# EAGLE board CORS_Time_Reference (EAGLE 9.6.2), part 1 of 2
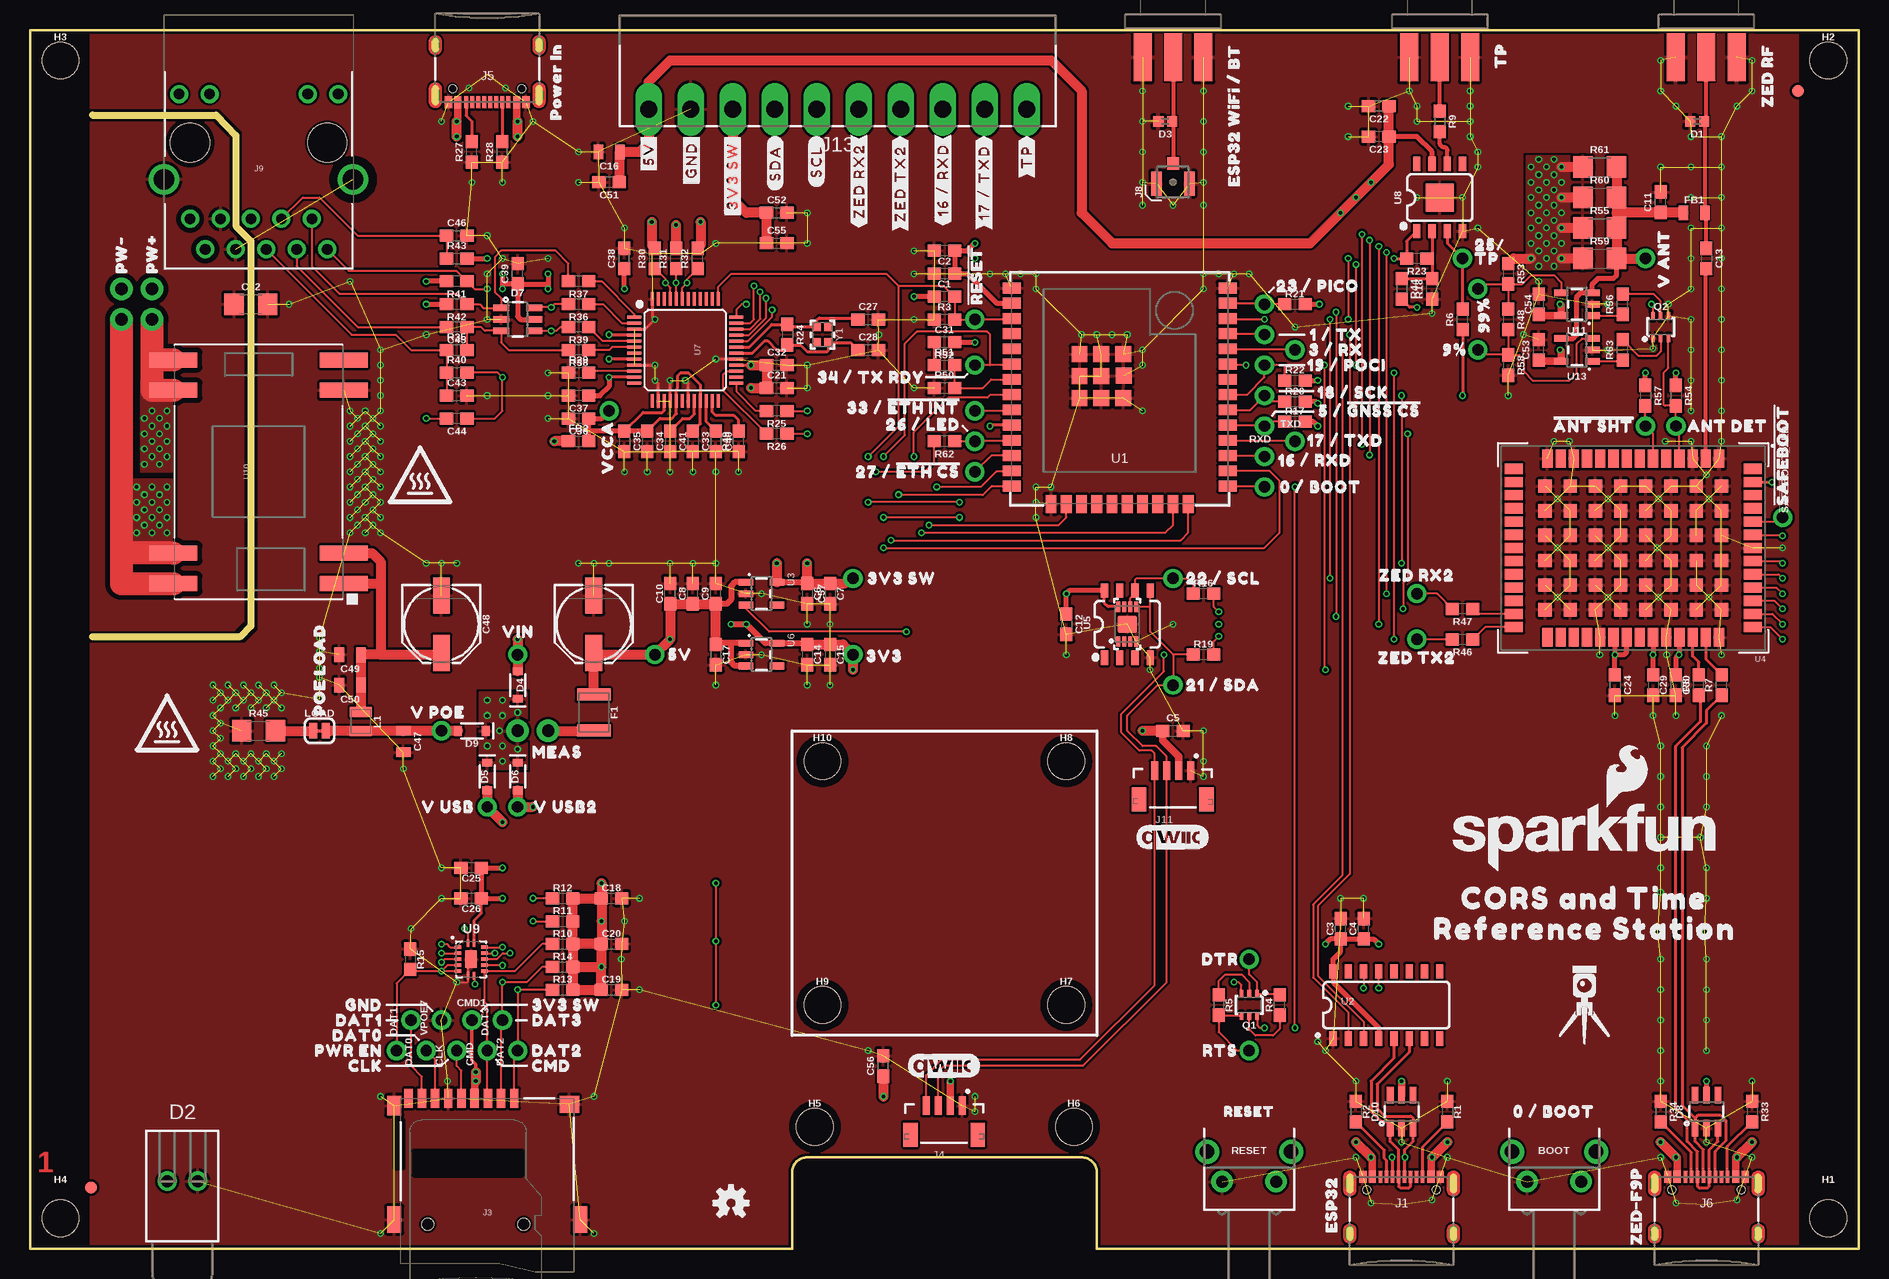
[diagram p1: board, top side]
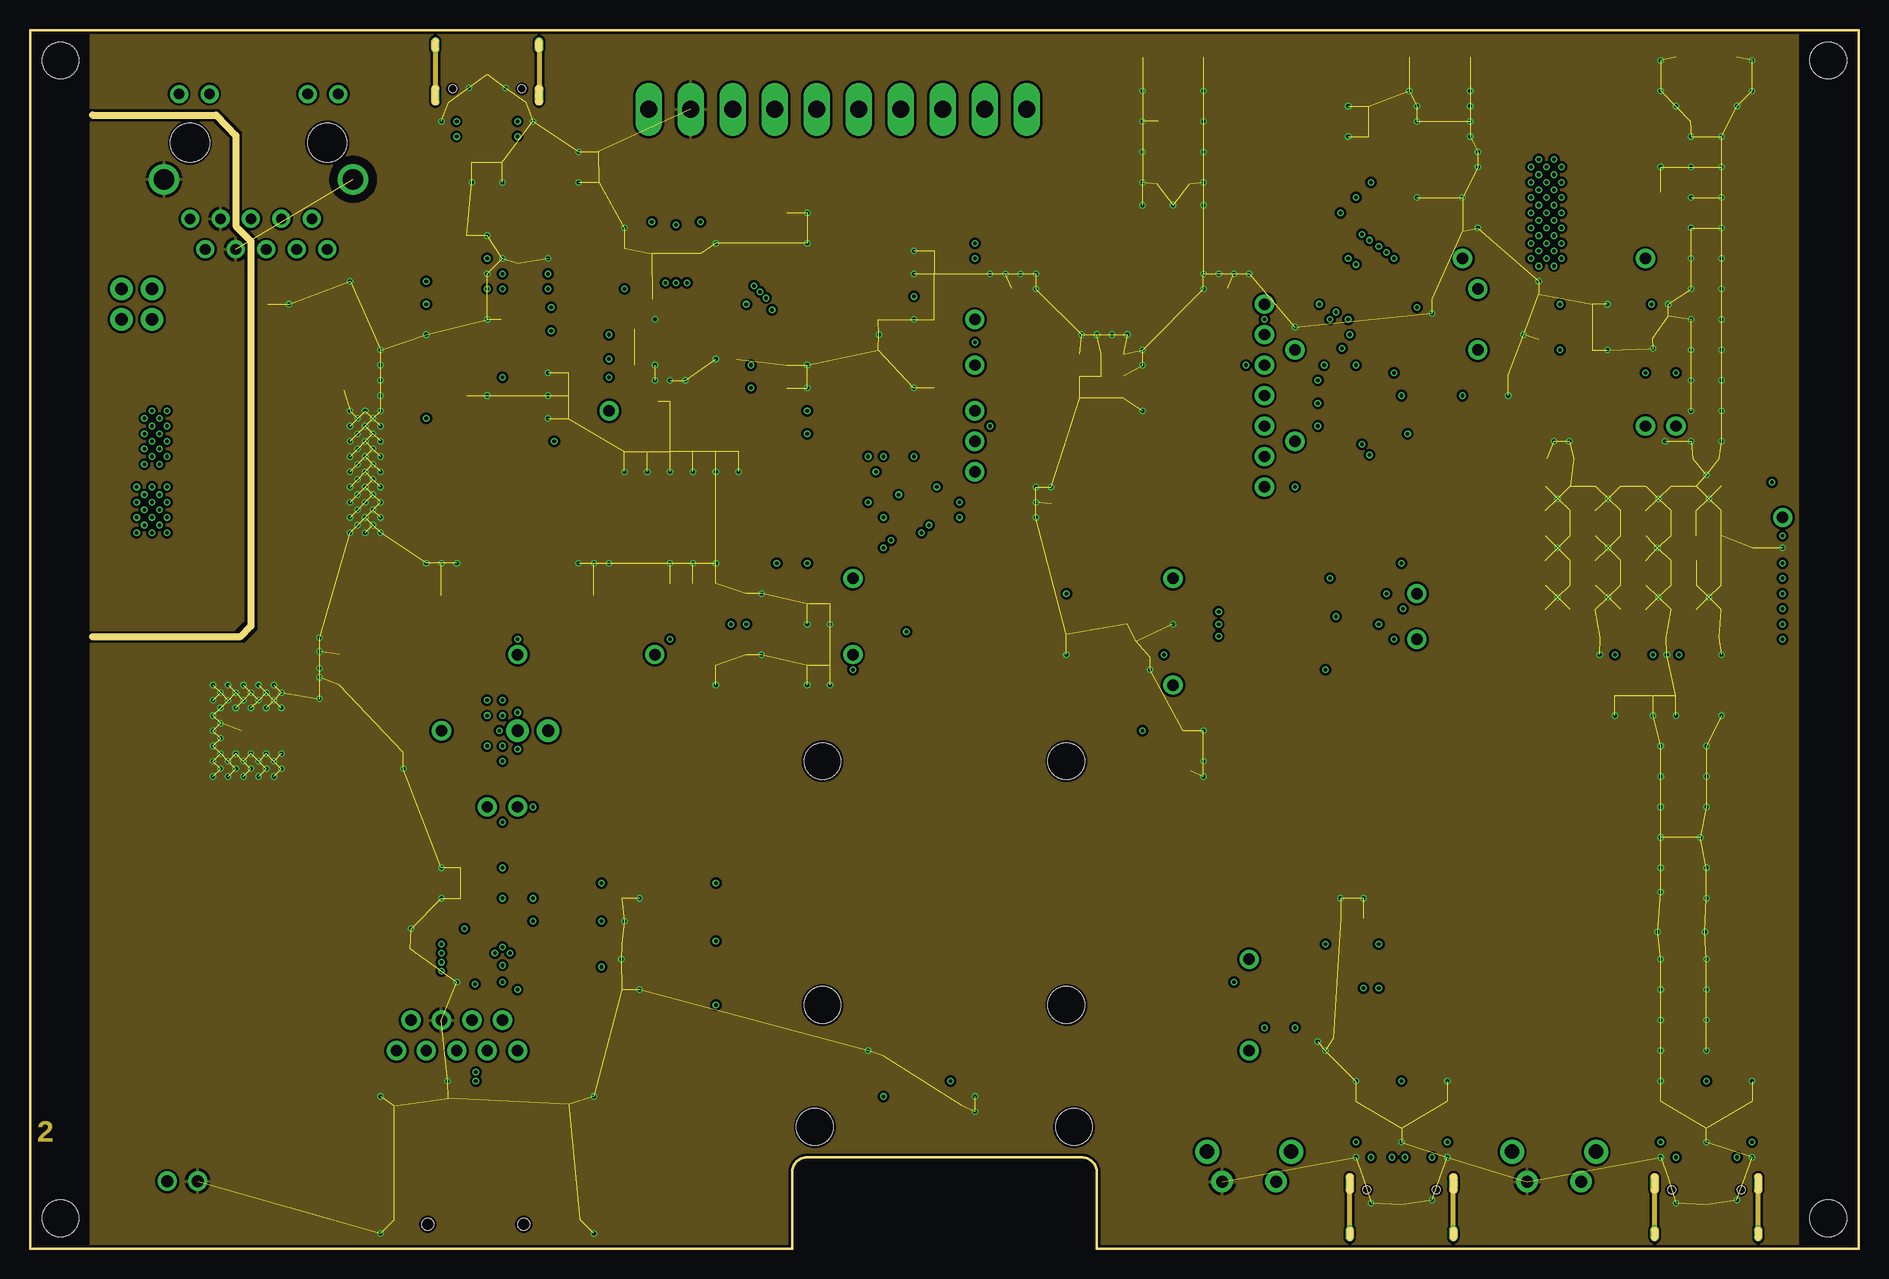
[diagram p2: board, inner layer Route2]
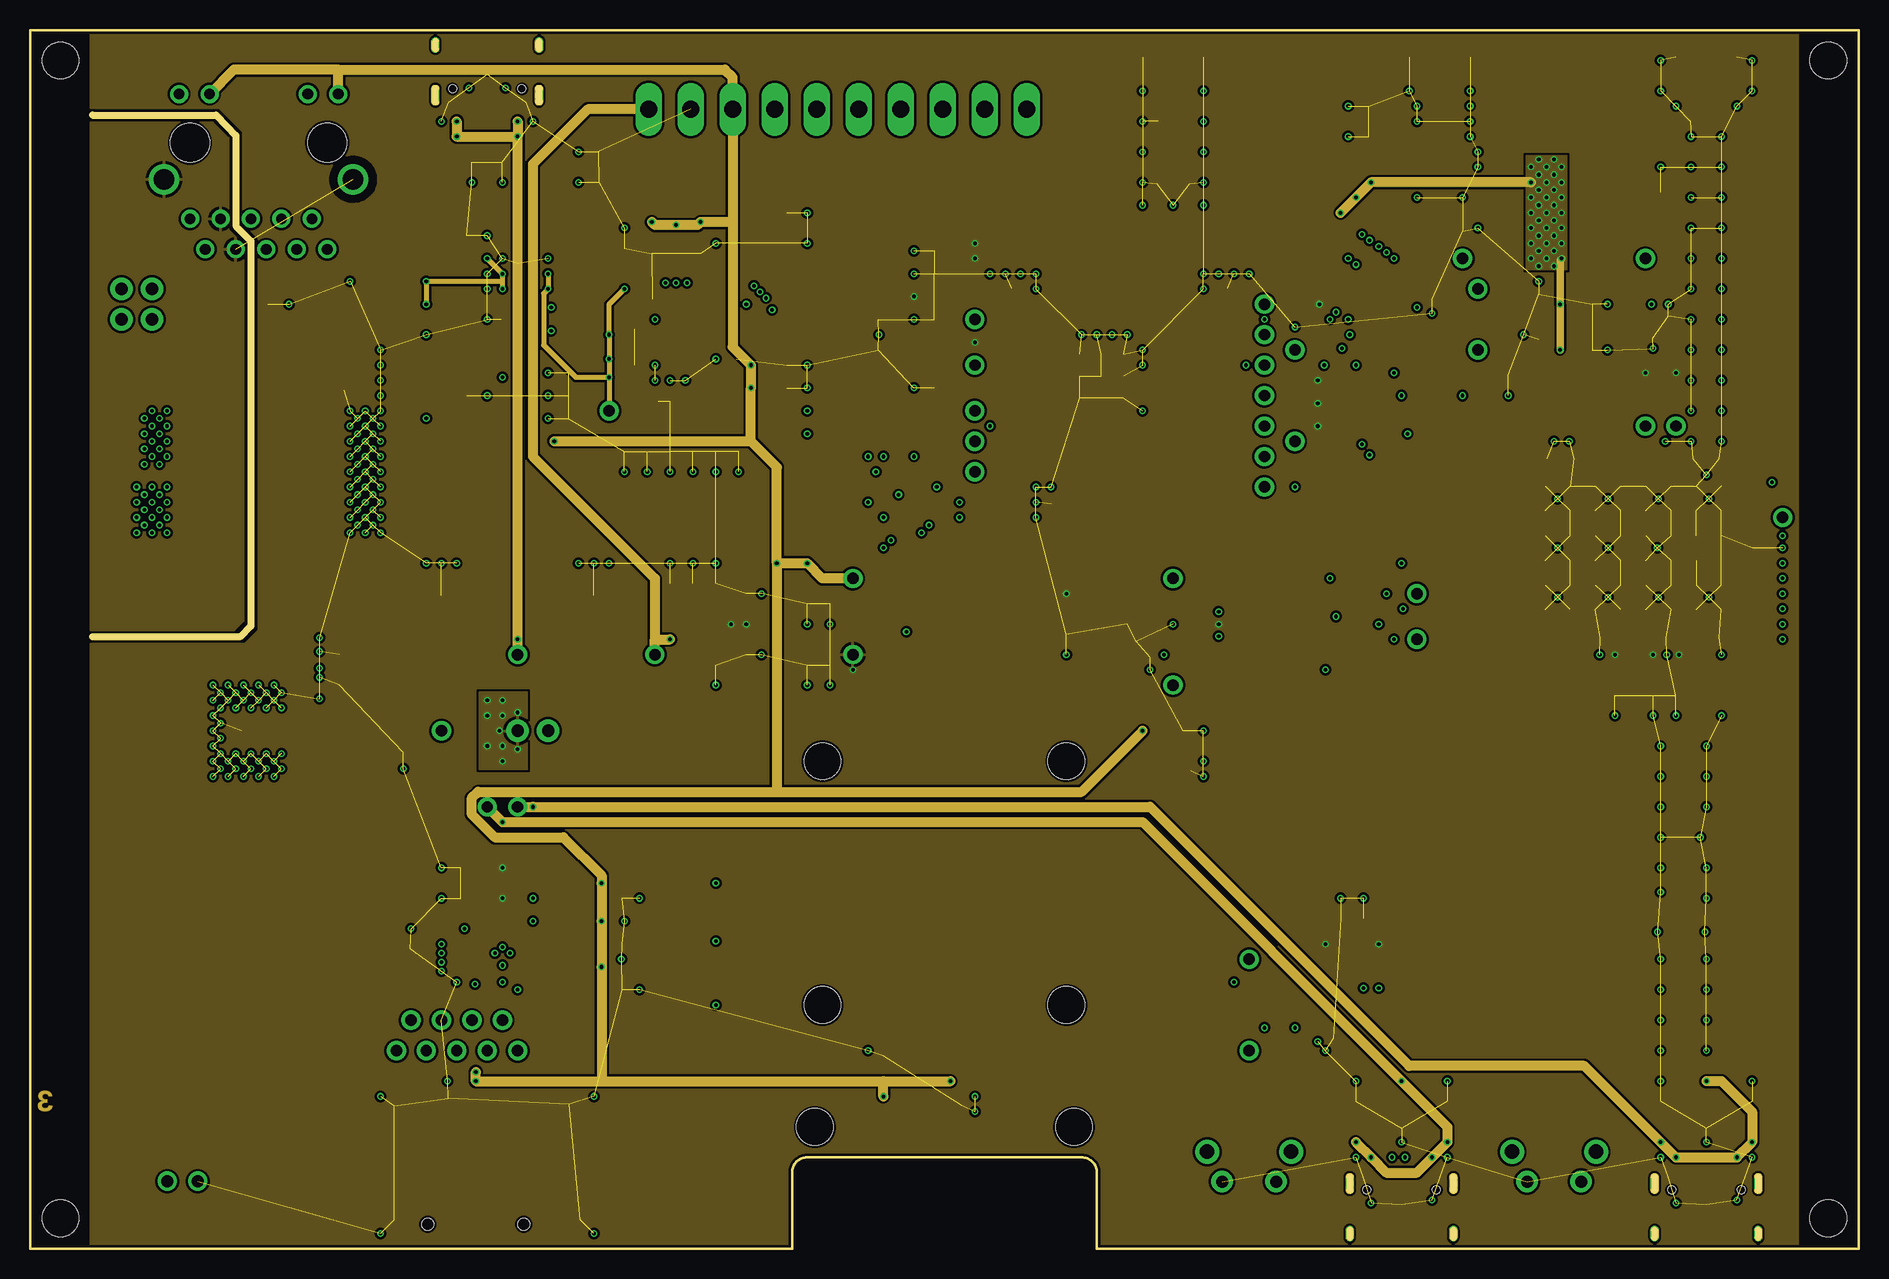
[diagram p3: board, inner layer Route15]
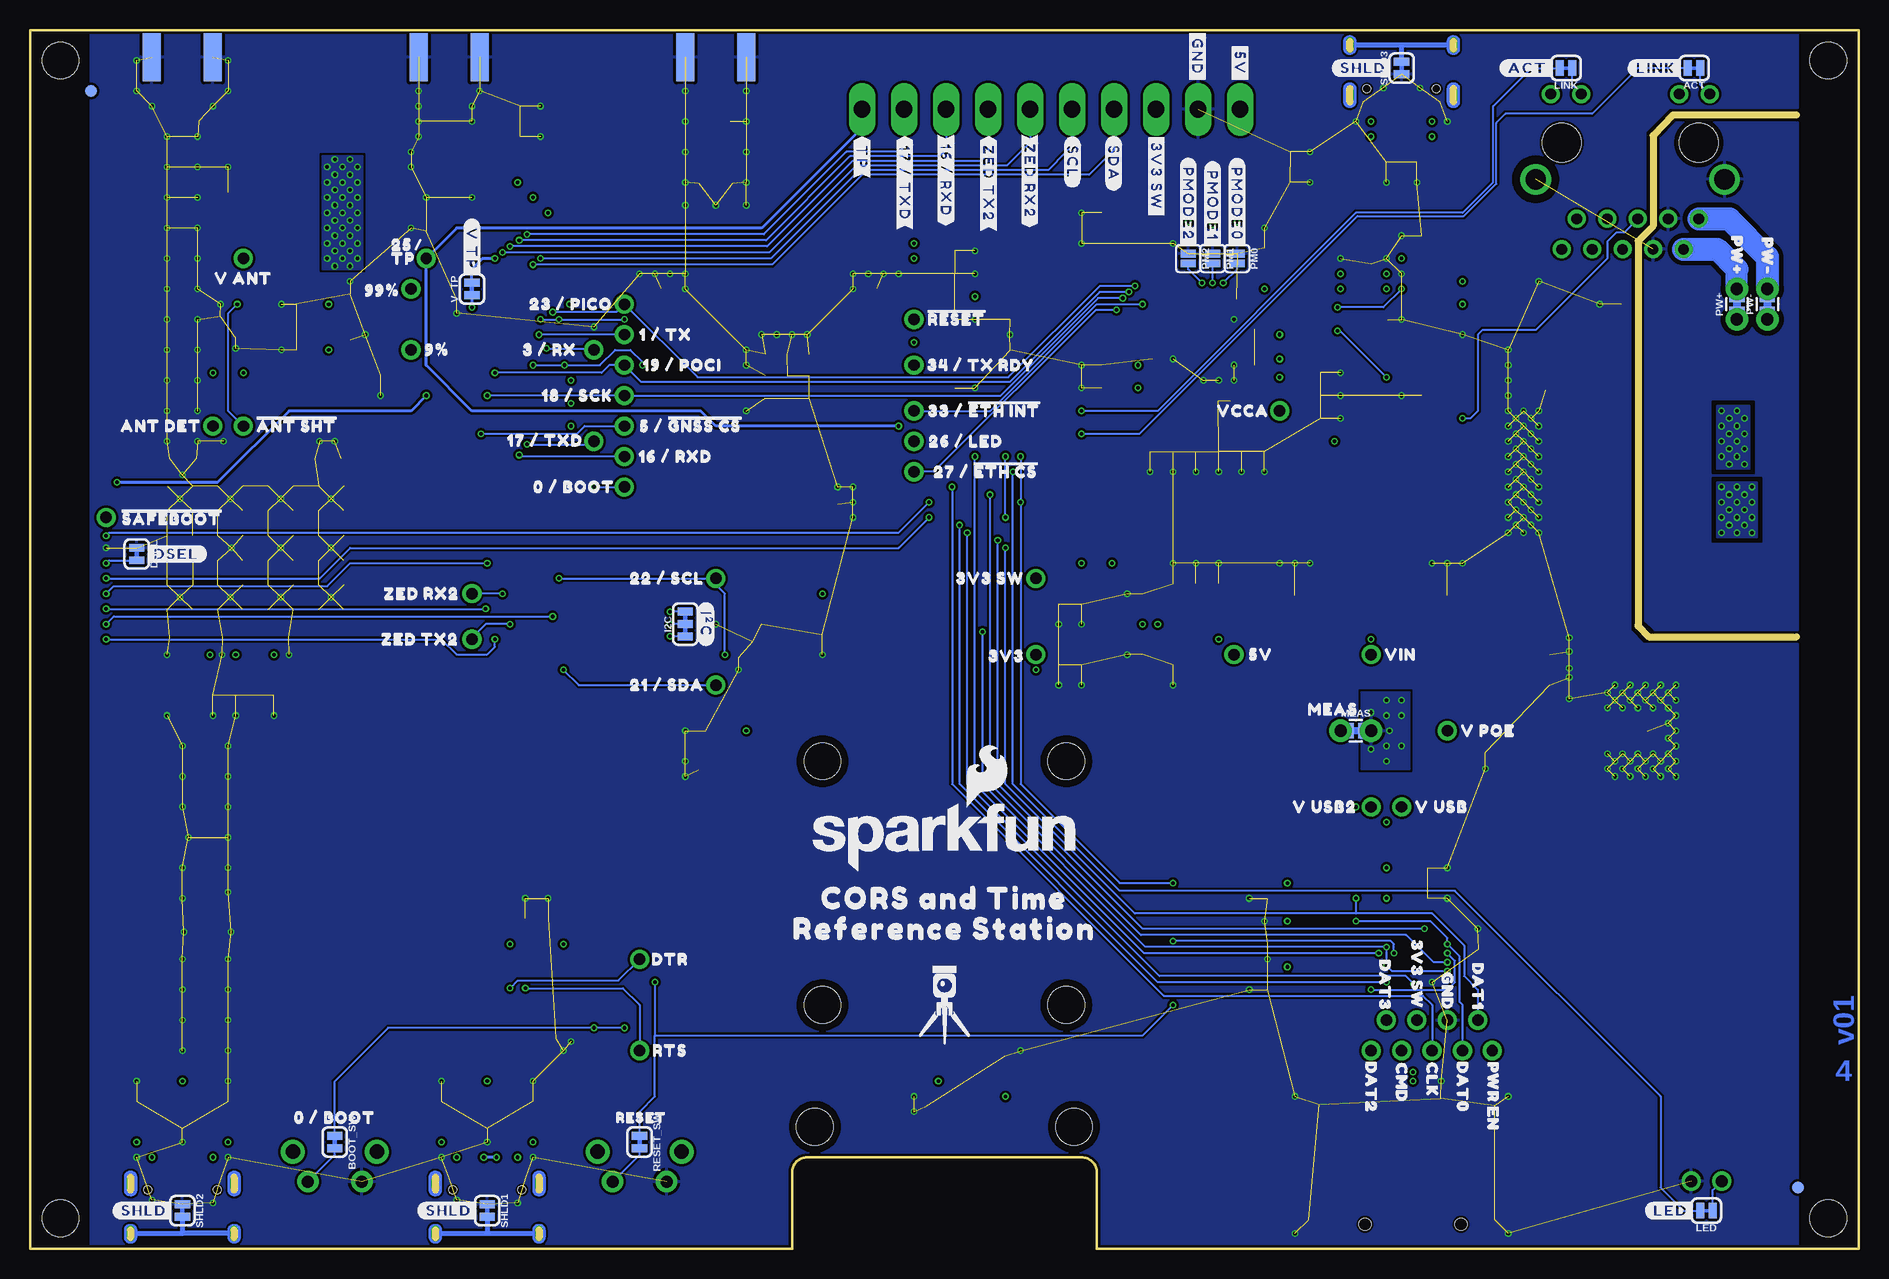
[diagram p4: board, bottom side, seen from below]

Size 152.4 x 101.6 mm. Coordinates in mm from the lower left corner, seen from the top.
Outline: 0,0 63.5,0 63.5,6.35 arc-90 64.77,7.62 87.63,7.62 arc-90 88.9,6.35 88.9,0 152.4,0 152.4,101.6 0,101.6 0,0
Copper layers (1*2*15*16): Top 0.035559375mm / dielectric 0.47751875mm / Route2 0.035559375mm / dielectric 0.47751875mm / Route15 0.035559375mm / dielectric 0.47751875mm / Bottom 0.035559375mm
Design rules "SparkFun-4-Layer-Minimum-JLCPCB": minimum track width 5mil, minimum drill 0.2mm, track to track 5mil, track to pad 5mil, pad to pad 5mil, via to via 5mil, smd to smd 5mil, copper to edge 7mil, drill to drill 7mil, minimum pad ring 5mil, minimum via ring 5mil, stop-mask expansion 2.5mil, vias tented up to drill 25mil, thermal gap 10mil
Net classes: 2 3.3V: width 0.508 mm; 3 RF_IN: width 0.35 mm, clearance 0.46 mm; 7 V_ZED: width 0.2 mm, clearance 0.2 mm; 8 V_RF: width 0.2 mm; 11 ZED_DIG: width 0.1 mm, clearance 0.1 mm
tKeepout: area 0,6.3 to 5.1,95.2; area 147.3,6.3 to 152.4,95.2
Milling: 7 lines

## Footprints (pad centres in the part's own frame; a part is rotated, then mirrored left to right if it is on the bottom)
1X01_NO_SILK = drill 0.95 pad 1.6: 1 0,0
SMT-JUMPER_2_NC_TRACE_SILK = smd 0.66 x 1.27: 1 -0.521,0; 2 0.521,0
TACTILE_SWITCH_PTH_RA_8-020 = drill 1 pad 1.8: 1 -2.25,0; 2 2.25,0 | drill 1.2 pad 2: M1 -3.5,2.5; M2 3.5,2.5
0603 = smd 1.1 x 1: 1 -0.85,0; 2 0.85,0
0805 = smd 0.8 x 1.2: 1 -0.9,0; 2 0.9,0
0603_NO_CREAM = smd 1.1 x 1: 1 -0.85,0; 2 0.85,0
1206 = smd 1.6 x 1.8: 1 -1.4,0; 2 1.4,0
PANASONIC_D = smd 3 x 1.4: + 2.4,0; - -2.4,0
0402 = smd 0.85 x 0.9: 1 -0.58,0; 2 0.58,0
CBI-RIGHT-ANGLE-PTH = drill 1 pad 1.6: A -1.27,5; C 1.27,5
SOD-323 = smd 0.63 x 0.83: A 1.15,0; C -1.15,0
SOT-23-6 = smd 0.55 x 1.35: 1 -0.95,-1.375; 2 0,-1.375; 3 0.95,-1.375; 4 0.95,1.375; 5 0,1.375; 6 -0.95,1.375
1210 = smd 1 x 2.8: 1 -1.5,0; 2 1.5,0
FIDUCIAL-1X2 = smd 1 x 1: 1 0,0
STAND-OFF-TIGHT = hole 3.048: 0,0
SMT-JUMPER_3_2-NC_TRACE_SILK = smd 0.66 x 1.27: 1 -1.041,0; 2 0,0; 3 1.041,0
USB-C-16P_4LAYER-PADS = smd 0.3 x 1: A5 -1.25,-0.34; A6 -0.25,-0.34; A7 0.25,-0.34; A8 1.25,-0.34; B5 1.75,-0.34; B6 0.75,-0.34; B7 -0.75,-0.34; B8 -1.75,-0.34 | smd 0.6 x 1: GND -3.225,-0.34; GND2 3.225,-0.34; VBUS1 -2.45,-0.34; VBUS2 2.45,-0.34 | drill 0.4 pad 0.6 long: SHLD1 -4.318,-0.915; SHLD2 4.318,-0.915; SHLD3 -4.318,-5.095; SHLD4 4.318,-5.095 | hole 0.65: -2.89,-1.445; 2.89,-1.445
SMA-EDGE = smd 1.5 x 4: GND@0 -2.54,0; GND@1 2.54,0; SIG 0,0 | smd 1.5 x 4 bottom: GND@2 -2.54,0; GND@3 2.54,0
MICROSD-EXTERNALPIN = smd 0.7 x 1.6: 1 2.25,10.5; 2 1.15,10.5; 3 0.05,10.5; 4 -1.05,10.5; 5 -2.15,10.5; 6 -3.25,10.5; 7 -4.35,10.5; 8 -5.45,10.5; 9 -6.55,10.5 | smd 1.2 x 1.6: 10 -7.75,9.9 | smd 1.2 x 2.2: 11 -7.75,0.4; 12 7.75,0.4 | smd 1.6 x 1.4: 13 6.85,10 | hole 1: 3.05,0; -4.95,0
JST04_1MM_VERT = smd 0.6 x 1.55: 1 -1.478,0.775; 2 -0.478,0.775; 3 0.522,0.775; 4 1.522,0.775 | smd 1.2 x 2: NC1 -2.778,3.2; NC2 2.822,3.2
RP-SMA-EDGE = smd 1.5 x 4: GND@0 -2.54,0; GND@1 2.54,0; SIG 0,0 | smd 1.5 x 4 bottom: GND@2 -2.54,0; GND@3 2.54,0
U.FL_REDUCED_FOOTPRINT = smd 2 x 0.85: 1 -0.1,1.375; 2 -0.1,-1.375 | smd 1.05 x 1: FEED 1.575,0
MAGJACK-SYM_LED = drill 0.9 pad 1.5: 1 -5.715,8.89; 2 -4.445,6.35; 3 -3.175,8.89; 4 -1.905,6.35; 5 -0.635,8.89; 6 0.635,6.35; 7 1.905,8.89; 8 3.175,6.35; 9 4.445,8.89; 10 5.715,6.35; 11 -6.63,-4.06; 12 -4.09,-4.06; 13 4.09,-4.06; 14 6.63,-4.06 | drill 1.7 pad 2.4: S1 -7.875,3.05; S2 7.875,3.05 | hole 3.25: -5.715,0; 5.715,0
1X10_SCREW_TERMINAL_3.5MM = drill 1.4 pad 2.2 long: 1 -15.75,2.8; 2 -12.25,2.8; 3 -8.75,2.8; 4 -5.25,2.8; 5 -1.75,2.8; 6 1.75,2.8; 7 5.25,2.8; 8 8.75,2.8; 9 12.25,2.8; 10 15.75,2.8
0805-WIDE = smd 0.8 x 1.8: 1 -0.8,0; 2 0.8,0
COMBO-JUMPER_2_NC_TRACE = smd 0.635 x 1.27: 1 -0.508,0; 2 0.508,0 | drill 1.016 pad 1.88: 3 -1.27,0; 4 1.27,0
SMT-JUMPER_2_NO_SILK = smd 0.635 x 1.27: 1 -0.406,0; 2 0.406,0
SC70-6 = smd 0.3 x 0.66: 1 -0.65,-0.92; 2 0,-0.92; 3 0.65,-0.92; 4 0.65,0.92; 5 0,0.92; 6 -0.65,0.92
ESP-WROOM-32EU = smd 0.9 x 1.5: 1 6.43,9; 2 5.16,9; 3 3.89,9; 4 2.62,9; 5 1.35,9; 6 0.08,9; 7 -1.19,9; 8 -2.46,9; 9 -3.73,9; 10 -5,9; 11 -6.27,9; 12 -7.54,9; 13 -8.81,9; 14 -10.08,9; 25 -10.08,-9; 26 -8.81,-9; 27 -7.54,-9; 28 -6.27,-9; 29 -5,-9; 30 -3.73,-9; 31 -2.46,-9; 32 -1.19,-9; 33 0.08,-9; 34 1.35,-9; 35 2.62,-9; 36 3.89,-9; 37 5.16,-9; 38 6.43,-9 | smd 1.5 x 0.9: 15 -11.57,5.715; 16 -11.57,4.445; 17 -11.57,3.175; 18 -11.57,1.905; 19 -11.57,0.635; 20 -11.57,-0.635; 21 -11.57,-1.905; 22 -11.57,-3.175; 23 -11.57,-4.445; 24 -11.57,-5.715 | smd 1.33 x 1.33: GND -0.912,1.531; GNDT1 -2.751,3.346; GNDT2 -2.761,1.516; GNDT3 -2.751,-0.314; GNDT4 -0.891,-0.324; GNDT5 0.909,-0.314; GNDT6 0.909,1.516; GNDT7 0.909,3.346; GNDT8 -0.921,3.346
SO016 = smd 0.6 x 1.2: 1 -4.445,-2.8; 2 -3.175,-2.8; 3 -1.905,-2.8; 4 -0.635,-2.8; 5 0.635,-2.8; 6 1.905,-2.8; 7 3.175,-2.8; 8 4.445,-2.8; 9 4.445,2.8; 10 3.175,2.8; 11 1.905,2.8; 12 0.635,2.8; 13 -0.635,2.8; 14 -1.905,2.8; 15 -3.175,2.8; 16 -4.445,2.8
SOT23-5 = smd 0.55 x 1.2: 1 -0.95,-1.3; 2 0,-1.3; 3 0.95,-1.3; 4 0.95,1.3; 5 -0.95,1.3
ZED-F9P = smd 0.85 x 1.52: 1 -7.15,-7.45; 2 -6.05,-7.45; 3 -4.95,-7.45; 4 -3.85,-7.45; 5 -2.75,-7.45; 6 -1.65,-7.45; 7 -0.55,-7.45; 8 0.55,-7.45; 9 1.65,-7.45; 10 2.75,-7.45; 11 3.85,-7.45; 12 4.95,-7.45; 13 6.05,-7.45; 14 7.15,-7.45; 28 7.15,7.45; 29 6.05,7.45; 30 4.95,7.45; 31 3.85,7.45; 32 2.75,7.45; 33 1.65,7.45; 34 0.55,7.45; 35 -0.55,7.45; 36 -1.65,7.45; 37 -2.75,7.45; 38 -3.85,7.45; 39 -4.95,7.45; 40 -6.05,7.45; 41 -7.15,7.45 | smd 1.52 x 0.85: 15 9.95,-6.6; 16 9.95,-5.5; 17 9.95,-4.4; 18 9.95,-3.3; 19 9.95,-2.2; 20 9.95,-1.1; 21 9.95,0; 22 9.95,1.1; 23 9.95,2.2; 24 9.95,3.3; 25 9.95,4.4; 26 9.95,5.5; 27 9.95,6.6; 42 -9.95,6.6; 43 -9.95,5.5; 44 -9.95,4.4; 45 -9.95,3.3; 46 -9.95,2.2; 47 -9.95,1.1; 48 -9.95,0; 49 -9.95,-1.1; 50 -9.95,-2.2; 51 -9.95,-3.3; 52 -9.95,-4.4; 53 -9.95,-5.5; 54 -9.95,-6.6 | smd 1.1 x 1.1: 55 -1.05,-1.05; 56 -3.15,-1.05; 57 -5.25,-1.05; 58 -7.35,-1.05; 59 -1.05,-3.1; 60 -3.15,-3.1; 61 -5.25,-3.1; 62 -7.35,-3.1; 63 -1.05,-5.15; 64 -3.15,-5.15; 65 -5.25,-5.15; 66 -7.35,-5.15; 67 -1.05,5.15; 68 -3.15,5.15; 69 -5.25,5.15; 70 -7.35,5.15; 71 -1.05,3.1; 72 -3.15,3.1; 73 -5.25,3.1; 74 -7.35,3.1; 75 -1.05,1.05; 76 -3.15,1.05; 77 -5.25,1.05; 78 -7.35,1.05; 79 1.05,1.05; 80 3.15,1.05; 81 5.25,1.05; 82 7.35,1.05; 83 1.05,3.1; 84 3.15,3.1; 85 5.25,3.1; 86 7.35,3.1; 87 1.05,5.15; 88 3.15,5.15; 89 5.25,5.15; 90 7.35,5.15; 91 1.05,-5.15; 92 3.15,-5.15; 93 5.25,-5.15; 94 7.35,-5.15; 95 1.05,-3.1; 96 3.15,-3.1; 97 5.25,-3.1; 98 7.35,-3.1; 99 1.05,-1.05; 100 3.15,-1.05; 101 5.25,-1.05; 102 7.35,-1.05
DUAL_UDFN_2X3MM_SOIC-8 = smd 0.3 x 0.85: 1 -0.75,-1.45; 2 -0.25,-1.45; 3 0.25,-1.45; 4 0.75,-1.45; 5 0.75,1.45; 6 0.25,1.45; 7 -0.25,1.45; 8 -0.75,1.45 | smd 0.6 x 1.2: 1S -1.905,-2.8; 2S -0.635,-2.8; 3S 0.635,-2.8; 4S 1.905,-2.8; 5S 1.905,2.8; 6S 0.635,2.8; 7S -0.635,2.8; 8S -1.905,2.8 | smd 1.6 x 1.4: P 0,0
LQFP-48 = smd 0.254 x 1.143: 1 -2.75,-4.25; 2 -2.25,-4.25; 3 -1.75,-4.25; 4 -1.25,-4.25; 5 -0.75,-4.25; 6 -0.25,-4.25; 7 0.25,-4.25; 8 0.75,-4.25; 9 1.25,-4.25; 10 1.75,-4.25; 11 2.25,-4.25; 12 2.75,-4.25; 25 2.75,4.25; 26 2.25,4.25; 27 1.75,4.25; 28 1.25,4.25; 29 0.75,4.25; 30 0.25,4.25; 31 -0.25,4.25; 32 -0.75,4.25; 33 -1.25,4.25; 34 -1.75,4.25; 35 -2.25,4.25; 36 -2.75,4.25 | smd 1.143 x 0.254: 13 4.25,-2.75; 14 4.25,-2.25; 15 4.25,-1.75; 16 4.25,-1.25; 17 4.25,-0.75; 18 4.25,-0.25; 19 4.25,0.25; 20 4.25,0.75; 21 4.25,1.25; 22 4.25,1.75; 23 4.25,2.25; 24 4.25,2.75; 37 -4.25,2.75; 38 -4.25,2.25; 39 -4.25,1.75; 40 -4.25,1.25; 41 -4.25,0.75; 42 -4.25,0.25; 43 -4.25,-0.25; 44 -4.25,-0.75; 45 -4.25,-1.25; 46 -4.25,-1.75; 47 -4.25,-2.25; 48 -4.25,-2.75
SO08_PAD = smd 0.6 x 1.2: 1 -1.905,-2.8; 2 -0.635,-2.8; 3 0.635,-2.8; 4 1.905,-2.8; 5 1.905,2.8; 6 0.635,2.8; 7 -0.635,2.8; 8 -1.905,2.8 | smd 2.311 x 2.311: PAD 0,0
14-QFN = smd 0.25 x 0.6: 1 -0.25,1.35; 7 -0.25,-1.35; 8 0.25,-1.35; 14 0.25,1.35 | smd 0.6 x 0.25: 2 -1.1,1; 3 -1.1,0.5; 4 -1.1,0; 5 -1.1,-0.5; 6 -1.1,-1; 9 1.1,-1; 10 1.1,-0.5; 11 1.1,0; 12 1.1,0.5; 13 1.1,1 | smd 1 x 1.5: EPAD 0,0
DP990X = smd 1.25 x 4: 1 -9.33,-7.1; 2 -6.79,-7.1; 3 6.79,-7.1; 4 9.33,-7.1; 5 9.33,7.1; 6 6.79,7.1; 7 -6.79,7.1; 8 -9.33,7.1
CRYSTAL-SMD-2.0X1.6MM = smd 0.75 x 0.7: 1 -0.675,-0.5; 2 0.675,-0.5; 3 0.675,0.5; 4 -0.675,0.5

## Placement (x,y rotation side)
3V3  TEST-POINTPOGO_PTH  [1X01_NO_SILK]  68.58,49.53 0 top
3V3_SW  TEST-POINTPOGO_PTH  [1X01_NO_SILK]  68.58,55.88 0 top
5V  TEST-POINTPOGO_PTH  [1X01_NO_SILK]  52.07,49.53 0 top
9%  TEST-POINTPOGO_PTH  [1X01_NO_SILK]  120.65,74.93 0 top
99%  TEST-POINTPOGO_PTH  [1X01_NO_SILK]  120.65,80.01 0 top
!SAFEBOOT_ZED!  TEST-POINTPOGO_PTH  [1X01_NO_SILK]  146.05,60.96 0 top
ACT  JUMPER-SMT_2_NC_TRACE_SILK  [SMT-JUMPER_2_NC_TRACE_SILK]  13.72,98.42 180 bottom
ANT_DET  TEST-POINTPOGO_PTH  [1X01_NO_SILK]  137.16,68.58 0 top
ANT_SHT  TEST-POINTPOGO_PTH  [1X01_NO_SILK]  134.62,68.58 0 top
BOOT  MOMENTARY-SWITCH-SPST-PTH-RIGHT-ANGLE-8-020  [TACTILE_SWITCH_PTH_RA_8-020]  127,5.59 0 top
BOOT_SW  JUMPER-SMT_2_NC_TRACE_SILK  [SMT-JUMPER_2_NC_TRACE_SILK]  127,8.89 270 bottom
C1  2.2uF  [0603]  76.2,81.28 180 top
C2  0.1uF  [0603]  76.2,83.19 180 top
C3  2.2uF  [0603]  109.22,26.67 90 top
C4  10nF  [0603]  111.12,26.67 90 top
C5  2.2uF  [0603]  95.25,43.18 0 top
C6  2.2uF  [0603]  64.77,54.61 270 top
C7  0.1uF  [0603]  66.67,54.61 270 top
C8  2.2uF  [0603]  55.24,54.61 90 top
C9  2.2uF  [0603]  57.15,54.61 90 top
C10  2.2uF  [0603]  53.34,54.61 90 top
C11  47pF  [0603]  135.89,87.25 90 top
C12  0.1uF  [0603]  86.36,52.07 270 top
C13  47pF  [0603]  139.7,82.55 270 top
C14  2.2uF  [0603]  64.77,49.53 270 top
C15  0.1uF  [0603]  66.67,49.53 270 top
C16  10uF  [0805]  48.26,91.44 180 top
C17  0.1uF  [0603]  57.15,49.53 270 top
C18  2.2uF  [0603]  48.45,29.21 0 top
C19  0.1uF  [0603]  48.45,21.59 0 top
C20  10uF  [0603]  48.45,25.4 0 top
C21  0.1uF  [0603]  62.23,71.75 0 top
C22  10uF  [0603]  112.39,95.25 180 top
C23  0.1uF  [0603]  112.39,92.71 180 top
C24  1.0uF  [0603]  132.08,46.99 270 top
C25  2.2uF  [0603]  36.77,31.75 180 top
C26  2.2uF  [0603]  36.77,29.21 180 top
C27  10pF  [0603]  69.85,77.47 0 top
C28  10pF  [0603]  69.85,74.93 0 top
C29  2.2uF  [0603]  135.25,46.99 270 top
C30  0.1uF  [0603]  137.16,46.99 270 top
C31  DNP  [0603_NO_CREAM]  76.2,77.47 180 top
C32  10uF  [0603]  62.23,73.66 0 top
C33  0.1uF  [0603]  55.24,67.31 270 top
C34  0.1uF  [0603]  51.44,67.31 270 top
C35  0.1uF  [0603]  49.53,67.31 270 top
C36  0.1uF  [0603]  45.72,69.22 180 top
C37  0.1uF  [0603]  45.72,71.12 180 top
C38  0.1uF  [0603]  49.53,82.55 90 top
C39  10uF  [0603]  40.64,81.28 90 top
C40  10nF  [0603]  57.15,67.31 270 top
C41  4.7uF  [0603]  53.34,67.31 270 top
C42  1nF  [1206]  18.4,78.74 0 top
C43  10nF  [0603]  35.56,71.12 0 top
C44  6.8nF  [0603]  35.56,69.22 180 top
C45  6.8nF  [0603]  35.56,76.83 180 top
C46  22nF  [0603]  35.56,84.45 0 top
C47  10uF  [0805]  31.11,42.29 270 top
C48  100uF  [PANASONIC_D]  34.29,52.07 270 top
C49  10uF  [0805]  26.67,49.53 180 top
C50  10uF  [0805]  26.67,46.99 180 top
C51  0.1uF  [0603]  48.26,88.9 180 top
C52  0.1uF  [0603]  62.23,86.36 0 top
C53  0.1uF  [0603]  125.73,74.93 90 top
C54  0.1uF  [0603]  125.73,78.74 90 top
C55  10uF  [0603]  62.23,83.82 0 top
C56  2.2uF  [0603]  71.12,15.24 90 top
C57  100uF  [PANASONIC_D]  46.99,52.07 270 top
CLK  TEST-POINTPOGO_PTH  [1X01_NO_SILK]  35.56,16.51 90 top
CMD  TEST-POINTPOGO_PTH  [1X01_NO_SILK]  38.1,16.51 90 top
CMD1  TEST-POINTPOGO_PTH  [1X01_NO_SILK]  36.83,19.05 0 top
D1  PESD0402-0402  [0402]  138.94,93.98 180 top
D2  LED-RIGHT-ANGLE-PTH-BLUE  [CBI-RIGHT-ANGLE-PTH]  12.7,0.64 0 top
D3  PESD0402-0402  [0402]  94.61,93.98 180 top
D4  3A/10V/280mV  [SOD-323]  40.64,46.99 90 top
D5  3A/10V/280mV  [SOD-323]  38.1,39.37 270 top
D6  3A/10V/280mV  [SOD-323]  40.64,39.37 270 top
D7  ESD Diode  [SOT-23-6]  40.64,77.47 270 top
D8  ESD Diode  [SOT-23-6]  139.7,11.43 0 top
D9  3A/10V/280mV  [SOD-323]  36.83,43.18 180 top
D10  ESD Diode  [SOT-23-6]  114.3,11.43 0 top
DAT0  TEST-POINTPOGO_PTH  [1X01_NO_SILK]  33.02,16.51 90 top
DAT1  TEST-POINTPOGO_PTH  [1X01_NO_SILK]  31.75,19.05 90 top
DAT2  TEST-POINTPOGO_PTH  [1X01_NO_SILK]  40.64,16.51 90 top
DAT3  TEST-POINTPOGO_PTH  [1X01_NO_SILK]  39.37,19.05 90 top
DSEL  JUMPER-SMT_2_NC_TRACE_SILK  [SMT-JUMPER_2_NC_TRACE_SILK]  143.51,57.91 270 bottom
DTR  TEST-POINTPOGO_PTH  [1X01_NO_SILK]  101.6,24.13 0 top
ETH_CS  TEST-POINTPOGO_PTH  [1X01_NO_SILK]  78.74,64.77 0 top
ETH_INT  TEST-POINTPOGO_PTH  [1X01_NO_SILK]  78.74,69.85 0 top
F1  6V/2A  [1210]  46.99,44.7 270 top
FB1  600Ω  [0805]  138.68,86.36 0 top
FB2  470Ω  [0603]  45.72,67.31 0 top
FD1  FIDUCIAL1X2  [FIDUCIAL-1X2]  5.08,5.08 0 bottom
FD2  FIDUCIAL1X2  [FIDUCIAL-1X2]  5.08,5.08 0 top
FD3  FIDUCIAL1X2  [FIDUCIAL-1X2]  147.32,96.52 0 bottom
FD4  FIDUCIAL1X2  [FIDUCIAL-1X2]  147.32,96.52 0 top
FRAME1  FRAME-LEDGER  [CREATIVE_COMMONS]  185.42,0 0 top  (outside the outline)
GNSS_CS  TEST-POINTPOGO_PTH  [1X01_NO_SILK]  102.87,68.58 0 top
H1  STAND-OFFTIGHT  [STAND-OFF-TIGHT]  149.86,2.54 0 top
H2  STAND-OFFTIGHT  [STAND-OFF-TIGHT]  149.86,99.06 0 top
H3  STAND-OFFTIGHT  [STAND-OFF-TIGHT]  2.54,99.06 0 top
H4  STAND-OFFTIGHT  [STAND-OFF-TIGHT]  2.54,2.54 0 top
H5  STAND-OFFTIGHT  [STAND-OFF-TIGHT]  65.41,10.16 0 top
H6  STAND-OFFTIGHT  [STAND-OFF-TIGHT]  87,10.16 0 top
H7  STAND-OFFTIGHT  [STAND-OFF-TIGHT]  86.36,20.32 0 top
H8  STAND-OFFTIGHT  [STAND-OFF-TIGHT]  86.36,40.64 0 top
H9  STAND-OFFTIGHT  [STAND-OFF-TIGHT]  66.04,20.32 0 top
H10  STAND-OFFTIGHT  [STAND-OFF-TIGHT]  66.04,40.64 0 top
I2C  JUMPER-SMT_3_2-NC_TRACE_SILK  [SMT-JUMPER_3_2-NC_TRACE_SILK]  97.79,52.07 90 bottom
J1  [USB-C-16P_4LAYER-PADS]  114.3,6.35 0 top
J2  ANTENNA-SMA-GROUNDEDEDGE_SMA  [SMA-EDGE]  139.7,99.31 0 top
J3  MICRO-SD-PUSH-PUSH-EXT-PIN  [MICROSD-EXTERNALPIN]  38.1,2.03 0 top
J4  Vertical Qwiic Connector  [JST04_1MM_VERT]  76.2,12.7 180 top
J5  [USB-C-16P_4LAYER-PADS]  38.1,95.25 180 top
J6  [USB-C-16P_4LAYER-PADS]  139.7,6.35 0 top
J7  ANTENNA-SMA-GROUNDEDEDGE_RPSMA  [RP-SMA-EDGE]  95.25,99.31 0 top
J8  [U.FL_REDUCED_FOOTPRINT]  95.25,88.9 90 top
J9  MAGJACK-POE  [MAGJACK-SYM_LED]  19.05,92.2 180 top
J10  ANTENNA-SMA-GROUNDEDEDGE_SMA  [SMA-EDGE]  117.47,99.31 0 top
J11  Vertical Qwiic Connector  [JST04_1MM_VERT]  95.25,40.64 180 top
J13  [1X10_SCREW_TERMINAL_3.5MM]  67.31,97.79 180 top
L1  2.2uH  [0805-WIDE]  27.56,43.94 270 top
LED  JUMPER-SMT_2_NC_TRACE_SILK  [SMT-JUMPER_2_NC_TRACE_SILK]  12.7,3.17 180 bottom
LINK  JUMPER-SMT_2_NC_TRACE_SILK  [SMT-JUMPER_2_NC_TRACE_SILK]  24.38,98.42 180 bottom
LOAD  JUMPER-SMT_2_NC_TRACE_SILK  [SMT-JUMPER_2_NC_TRACE_SILK]  24.13,43.18 0 top
LOGO1  SPECIAL_INSTRUCTIONS-ORDERING  [ORDERING_INSTRUCTIONS]  157.48,60.96 0 top  (outside the outline)
LOGO2  QWIIC_LOGO_6MM  [QWIIC_6MM]  76.2,15.24 0 top
LOGO3  QWIIC_LOGO_6MM  [QWIIC_6MM]  95.25,34.29 0 top
LOGO4  OSHW-LOGOS  [OSHW-LOGO-S]  58.42,3.81 0 top
LOGO5  SFE_LOGO_NAME.2_INCH  [SFE_LOGO_NAME_.2]  129.54,34.29 0 top
LOGO6  SFE_LOGO_FLAME.2_INCH  [SFE_LOGO_FLAME_.2]  133.1,39.37 0 top
LOGO7  SFE_LOGO_NAME.2_INCH  [SFE_LOGO_NAME_.2]  76.2,34.29 0 bottom
LOGO8  SFE_LOGO_FLAME.2_INCH  [SFE_LOGO_FLAME_.2]  72.64,39.37 0 bottom
MEAS  JUMPER-COMBO_2_NC_TRACE  [COMBO-JUMPER_2_NC_TRACE]  41.91,43.18 0 bottom
PICO  TEST-POINTPOGO_PTH  [1X01_NO_SILK]  102.87,78.74 0 top
PM0  JUMPER-SMT_2_NO_SILK  [SMT-JUMPER_2_NO_SILK]  51.82,82.55 270 bottom
PM1  JUMPER-SMT_2_NO_SILK  [SMT-JUMPER_2_NO_SILK]  53.85,82.55 270 bottom
PM2  JUMPER-SMT_2_NO_SILK  [SMT-JUMPER_2_NO_SILK]  55.88,82.55 270 bottom
POCI  TEST-POINTPOGO_PTH  [1X01_NO_SILK]  102.87,73.66 0 top
PW+  JUMPER-COMBO_2_NC_TRACE  [COMBO-JUMPER_2_NC_TRACE]  10.16,78.74 90 bottom
PW-  JUMPER-COMBO_2_NC_TRACE  [COMBO-JUMPER_2_NC_TRACE]  7.62,78.74 90 bottom
PWREN  TEST-POINTPOGO_PTH  [1X01_NO_SILK]  30.54,16.51 0 top
Q1  [SC70-6]  101.6,20.32 180 top
Q2  [SC70-6]  135.89,76.83 0 top
R1  5.1k  [0603]  118.11,11.43 270 top
R2  5.1k  [0603]  110.49,11.43 270 top
R3  10k  [0603]  76.2,79.38 180 top
R4  10k  [0603]  104.14,20.32 90 top
R5  10k  [0603]  99.06,20.32 270 top
R6  33  [0603]  119.38,77.47 90 top
R7  27  [0603]  140.97,46.99 90 top
R8  27  [0603]  139.06,46.99 90 top
R9  49.9  [0603]  117.47,93.98 270 top
R10  10k  [0603]  44.39,25.4 0 top
R11  10k  [0603]  44.39,27.3 0 top
R12  10k  [0603]  44.39,29.21 0 top
R13  10k  [0603]  44.39,21.59 0 top
R14  10k  [0603]  44.39,23.5 0 top
R15  100k  [0603]  31.69,24.13 270 top
R16  2.2k  [0603]  97.79,54.61 0 top
R17  100k  [0603]  105.41,68.96 0 top
R18  100k  [0603]  116.84,80.01 90 top
R19  2.2k  [0603]  97.79,49.53 0 top
R20  100k  [0603]  105.41,70.61 0 top
R21  100k  [0603]  105.41,78.74 0 top
R22  10k  [0603]  105.41,72.39 0 top
R23  100k  [0603]  115.57,82.55 180 top
R24  1M  [0603]  63.12,76.2 270 top
R25  1k  [0603]  62.23,69.85 180 top
R26  1k  [0603]  62.23,67.94 180 top
R27  5.1k  [0603]  36.83,91.44 90 top
R28  5.1k  [0603]  39.37,91.44 90 top
R29  12.4k  [0603]  45.72,73.03 0 top
R30  10k  [0603]  52.07,82.55 90 top
R31  10k  [0603]  53.85,82.55 90 top
R32  10k  [0603]  55.63,82.55 90 top
R33  5.1k  [0603]  143.51,11.43 270 top
R34  5.1k  [0603]  135.89,11.43 270 top
R35  49.9  [0603]  35.56,74.93 0 top
R36  33  [0603]  45.72,78.74 180 top
R37  33  [0603]  45.72,80.64 180 top
R38  33  [0603]  45.72,74.93 180 top
R39  33  [0603]  45.72,76.83 180 top
R40  49.9  [0603]  35.56,73.03 0 top
R41  49.9  [0603]  35.56,80.64 180 top
R42  49.9  [0603]  35.56,78.74 180 top
R43  10  [0603]  35.56,82.55 0 top
R44  1k  [0603]  114.3,80.01 270 top
R45  49.9 1/2W  [1206]  19.05,43.18 0 top
R46  33  [0603]  119.38,50.8 180 top
R47  33  [0603]  119.38,53.34 180 top
R48  100k  [0603]  123.19,77.47 270 top
R49  10k  [0603]  59.05,67.31 90 top
R50  10k  [0603]  76.2,71.75 0 top
R51  10k  [0603]  76.2,73.66 0 top
R52  10k  [0603]  76.2,75.56 180 top
R53  1k  [0603]  123.19,81.28 270 top
R54  10k  [0603]  137.16,71.12 270 top
R55  49.9 1/2W  [1206]  130.81,85.09 0 top
R56  1k  [0603]  132.72,78.74 90 top
R57  10k  [0603]  134.62,71.12 270 top
R58  10k  [0603]  123.19,73.66 270 top
R59  49.9 1/2W  [1206]  130.81,82.55 0 top
R60  49.9 1/2W  [1206]  130.81,87.63 0 top
R61  49.9 1/2W  [1206]  130.81,90.17 0 top
R62  470  [0603]  76.2,67.31 180 top
R63  1k  [0603]  132.72,74.93 90 top
RESET  MOMENTARY-SWITCH-SPST-PTH-RIGHT-ANGLE-8-020  [TACTILE_SWITCH_PTH_RA_8-020]  101.6,5.59 0 top
RESET_SW  JUMPER-SMT_2_NC_TRACE_SILK  [SMT-JUMPER_2_NC_TRACE_SILK]  101.6,8.89 270 bottom
RTS  TEST-POINTPOGO_PTH  [1X01_NO_SILK]  101.6,16.51 0 top
RX  TEST-POINTPOGO_PTH  [1X01_NO_SILK]  105.41,74.93 0 top
RX2  TEST-POINTPOGO_PTH  [1X01_NO_SILK]  115.57,54.61 0 top
RXD  TEST-POINTPOGO_PTH  [1X01_NO_SILK]  102.87,66.04 0 top
SCK  TEST-POINTPOGO_PTH  [1X01_NO_SILK]  102.87,71.12 0 top
SCL  TEST-POINTPOGO_PTH  [1X01_NO_SILK]  95.25,55.88 0 top
SDA  TEST-POINTPOGO_PTH  [1X01_NO_SILK]  95.25,46.99 0 top
SHLD1  JUMPER-SMT_2_NC_TRACE_SILK  [SMT-JUMPER_2_NC_TRACE_SILK]  114.3,3.17 270 bottom
SHLD2  JUMPER-SMT_2_NC_TRACE_SILK  [SMT-JUMPER_2_NC_TRACE_SILK]  139.7,3.17 270 bottom
SHLD3  JUMPER-SMT_2_NC_TRACE_SILK  [SMT-JUMPER_2_NC_TRACE_SILK]  38.1,98.42 90 bottom
TP  TEST-POINTPOGO_PTH  [1X01_NO_SILK]  119.38,82.55 0 top
TP_BOOT  TEST-POINTPOGO_PTH  [1X01_NO_SILK]  102.87,63.5 0 top
TP_LED  TEST-POINTPOGO_PTH  [1X01_NO_SILK]  78.74,67.31 0 top
TP_RESET  TEST-POINTPOGO_PTH  [1X01_NO_SILK]  78.74,77.47 0 top
TX  TEST-POINTPOGO_PTH  [1X01_NO_SILK]  102.87,76.2 0 top
TX2  TEST-POINTPOGO_PTH  [1X01_NO_SILK]  115.57,50.8 0 top
TX_RDY  TEST-POINTPOGO_PTH  [1X01_NO_SILK]  78.74,73.66 0 top
TXD  TEST-POINTPOGO_PTH  [1X01_NO_SILK]  105.41,67.31 0 top
U1  ESP-WROOM-32E  [ESP-WROOM-32EU]  90.81,73.66 90 top
U2  CH340C  [SO016]  113.03,20.32 0 top
U3  XC6222B331MR-G  [SOT23-5]  60.96,54.61 270 top
U4  U-BLOX_ZED-F9P  [ZED-F9P]  133.6,58.42 180 top
U5  ATECC608A  [DUAL_UDFN_2X3MM_SOIC-8]  91.44,52.07 0 top
U6  XC6222B331MR-G  [SOT23-5]  60.96,49.53 270 top
U7  W5500  [LQFP-48]  54.61,74.93 270 top
U8  ADC8045  [SO08_PAD]  117.47,87.63 0 top
U9  74HC4066_QUAD_BILATERAL_SWITCH_QFN  [14-QFN]  36.77,24.13 0 top
U10  POE_PSU-DP990X  [DP990X]  19.05,64.77 90 top
U11  OPA344  [SOT23-5]  128.91,78.74 90 top
U13  OPA344  [SOT23-5]  128.91,74.93 90 top
U$2  [RESET0]  101.6,11.43 0 top
U$3  [#SHLD#0]  140.34,3.17 0 bottom
U$4  [#SHLD#0]  38.73,98.42 0 bottom
U$5  [PW#0]  7.62,80.64 90 top
U$6  [PW#1]  10.16,80.64 90 top
U$7  [0_#_BOOT0]  127,11.43 0 top
U$8  [POWER_IN0]  43.81,97.28 90 top
U$9  [#ACT#0]  25.27,98.42 0 bottom
U$10  [#LINK#1]  14.61,98.42 0 bottom
U$11  [#3V3_SW#0]  58.55,92.96 90 top
U$12  [#5V#0]  51.56,92.96 90 top
U$13  [#GND#6]  55.12,92.96 90 top
U$14  [#ZED_RX2#0]  69.09,92.84 90 top
U$15  [#SCL#8]  65.53,92.71 90 top
U$16  [#SDA#7]  62.1,92.71 90 top
U$17  [#ZED_RX2#3]  69.09,92.84 270 bottom
U$18  [#ZED_TX2#0]  72.52,92.71 90 top
U$19  [#ZED_TX2#3]  72.52,92.71 270 bottom
U$20  [#16_#_RXD#0]  76.07,92.84 90 top
U$21  [ESP32_WIFI_#_BT0]  100.33,101.09 90 top
U$22  [TP0]  122.56,99.44 90 top
U$23  [ZED_RF0]  144.78,97.79 90 top
U$24  [VCCA0]  48.13,66.8 90 top
U$25  [#RESET#0]  78.74,81.15 90 top
U$26  [34_#_TX_RDY0]  70.1,72.64 0 top
U$27  [33_#_#ETH_INT#0]  72.77,70.23 0 top
U$28  [26_#_LED0]  74.42,68.71 0 top
U$29  [27_#_#ETH_CS#0]  73.15,64.9 0 top
U$30  [23_#_PICO23]  107.31,80.26 0 top
U$31  [22_#_SCL20]  99.44,55.88 0 top
U$32  [18_#_SCK6]  110.24,71.37 0 top
U$33  [19_#_POCI19]  109.73,73.66 0 top
U$34  [1_#_TX20]  108.84,76.2 0 top
U$35  [3_#_RX20]  108.84,74.93 0 top
U$36  [5_#_#GNSS_CS#1]  111.63,69.98 0 top
U$37  [0_#_BOOT0]  107.57,63.5 0 top
U$38  [21_#_SDA24]  99.44,46.99 0 top
U$39  [ZED_RX224]  115.57,56.13 0 top
U$40  [ZED_TX2225]  115.57,49.28 0 top
U$41  [#SAFEBOOT#2226]  145.92,66.17 90 top
U$42  [ANT_DET2227]  141.48,68.58 0 top
U$43  [#ANT_SHT#2228]  130.3,68.71 0 top
U$44  [9#2230]  118.75,74.93 0 top
U$45  [#SHLD#0]  114.94,3.17 0 bottom
U$46  [#I�C#0]  96.08,52.07 270 bottom
U$47  [99#2230]  121.16,77.85 90 top
U$48  [TP2230]  121.41,82.55 0 top
U$49  [V_ANT2229]  136.14,82.55 90 top
U$55  [RTS2231]  99.19,16.51 0 top
U$56  [DTR2232]  99.19,24.13 0 top
U$57  [3V3_SW15]  36.83,22.86 270 bottom
U$58  [#LED#2234]  13.59,3.17 0 bottom
U$59  [3V3_SW25]  76.2,55.88 0 top
U$60  [3V325]  73.41,49.4 0 top
U$61  [5V25]  55.88,49.53 0 top
U$62  [MEAS2]  46.74,41.4 0 top
U$63  [VIN1]  42.67,51.44 0 top
U$64  [V_USB3]  37.72,36.83 0 top
U$65  [V_USB24]  48.01,36.83 0 top
U$66  [V_POE0]  36.96,44.7 0 top
U$67  [#PMODE0#0]  51.82,83.31 270 bottom
U$68  [#PMODE1#1]  53.85,83.31 270 bottom
U$69  [#PMODE2#2]  55.88,83.31 270 bottom
U$70  [CORS_AND_TIME0]  129.54,29.21 0 top
U$71  [#V_TP#3]  115.57,80.9 270 bottom
U$72  [#DSEL#0]  137.67,57.91 0 bottom
U$73  [REFERENCE_STATION1]  129.54,26.67 0 top
U$74  [CORS_AND_TIME0]  76.2,29.21 0 bottom
U$75  [REFERENCE_STATION1]  76.2,26.67 0 bottom
U$76  [RTS2231]  99.06,16.51 0 bottom
U$77  [DTR2232]  99.06,24.13 0 bottom
U$78  [ESP320]  108.46,3.68 90 top
U$79  [ZED#F9P321]  133.86,3.56 90 top
U$80  [PWR_EN2233]  30.48,12.7 270 bottom
U$81  [V_POE0]  27.94,43.18 0 bottom
U$82  [V_USB3]  31.88,36.83 0 bottom
U$83  [V_USB24]  41.15,36.83 0 bottom
U$84  [MEAS2]  41.02,44.96 0 bottom
U$85  [VIN1]  36.2,49.53 0 bottom
U$86  [5V25]  48.13,49.53 0 bottom
U$87  [3V325]  68.83,49.4 0 bottom
U$88  [3V3_SW25]  68.83,55.88 0 bottom
U$89  [22_#_SCL20]  99.31,55.88 0 bottom
U$90  [21_#_SDA24]  99.31,46.99 0 bottom
U$91  [ZED_RX224]  119.76,54.61 0 bottom
U$92  [ZED_TX2225]  119.89,50.8 0 bottom
U$93  [#SAFEBOOT#2226]  140.59,60.96 0 bottom
U$94  [ANT_DET2227]  141.48,68.58 0 bottom
U$95  [#ANT_SHT#2228]  130.18,68.71 0 bottom
U$96  [0_#_BOOT0]  107.06,63.5 0 bottom
U$97  [5_#_#GNSS_CS#1]  97.35,68.71 0 bottom
U$98  [23_#_PICO23]  107.31,78.74 0 bottom
U$99  [1_#_TX20]  99.44,76.2 0 bottom
U$100  [3_#_RX20]  109.09,74.93 0 bottom
U$101  [19_#_POCI19]  98.04,73.66 0 bottom
U$102  [18_#_SCK6]  106.81,71.12 0 bottom
U$103  [TP2230]  121.28,82.55 0 bottom
U$104  [99#2230]  123.06,79.88 0 bottom
U$105  [V_ANT2229]  134.62,80.9 0 bottom
U$106  [9#2230]  118.49,74.93 0 bottom
U$107  [VCCA0]  51.31,69.85 0 bottom
U$108  [34_#_TX_RDY0]  73.15,73.66 0 bottom
U$109  [33_#_#ETH_INT#0]  72.9,69.98 0 bottom
U$110  [26_#_LED0]  74.42,67.31 0 bottom
U$111  [27_#_#ETH_CS#0]  72.77,64.9 0 bottom
U$112  [#RESET#0]  75.18,77.6 0 bottom
U$113  [PW#0]  7.62,84.96 270 bottom
U$114  [PW#1]  10.16,85.09 270 bottom
U$115  [#3V3_SW#0]  58.55,85.85 270 bottom
U$116  [#SDA#7]  62.1,88.27 270 bottom
U$117  [#SCL#8]  65.53,88.52 270 bottom
U$118  [#16_#_RXD#17]  76.07,92.84 270 bottom
U$119  [#17_#_TXD#0]  79.5,92.71 90 top
U$120  [#17_#_TXD#18]  79.5,92.71 270 bottom
U$121  [#TP#0]  83.06,92.71 90 top
U$122  [#TP#1]  83.06,92.71 270 bottom
U$123  [#GND#6]  55.12,97.16 270 bottom
U$124  [#5V#0]  51.56,97.16 270 bottom
U$125  [16_#_RXD18]  107.06,65.72 0 top
U$126  [16_#_RXD18]  98.62,66.04 0 bottom
U$127  [17_#_TXD0]  109.6,67.37 0 top
U$128  [17_#_TXD0]  109.47,67.37 0 bottom
U$129  [CLK13]  35.56,14.1 270 bottom
U$130  [CMD14]  38.1,13.84 270 bottom
U$131  [DAT10]  31.75,21.84 270 bottom
U$132  [DAT011]  33.02,13.46 270 bottom
U$133  [DAT315]  39.5,21.97 270 bottom
U$134  [DAT2316]  40.64,13.46 270 bottom
U$135  [GND12]  34.29,21.46 270 bottom
U$136  [POE_LOAD0]  24.13,48.26 90 top
U$137  [DAT2316]  43.94,16.51 0 top
U$138  [CMD14]  43.43,15.24 0 top
U$139  [CLK13]  27.94,15.24 0 top
U$140  [DAT011]  27.3,17.78 0 top
U$141  [PWR_EN2233]  26.54,16.51 0 top
U$142  [DAT10]  27.43,19.05 0 top
U$143  [GND12]  27.81,20.32 0 top
U$144  [3V3_SW15]  44.7,20.32 0 top
U$145  [DAT315]  43.94,19.05 0 top
U$146  [HIGH_TEMP_WARNING]  11.43,43.18 0 top
U$147  [HIGH_TEMP_WARNING]  32.51,63.88 0 top
U$148  [RESET0]  101.47,10.92 0 bottom
U$149  [0_#_BOOT0]  127,10.92 0 bottom
U$150  [250]  121.28,83.69 0 top
U$151  [250]  121.41,83.69 0 bottom
U$152  [RTK5#SVG0]  129.53,20.32 0 top
U$153  [RTK5#SVG0]  76.19,20.32 0 bottom
V_TP  JUMPER-SMT_2_NC_TRACE_SILK  [SMT-JUMPER_2_NC_TRACE_SILK]  115.57,80.01 90 bottom
VANT  TEST-POINTPOGO_PTH  [1X01_NO_SILK]  134.62,82.55 0 top
VCCA  TEST-POINTPOGO_PTH  [1X01_NO_SILK]  48.26,69.85 0 top
VIN  TEST-POINTPOGO_PTH  [1X01_NO_SILK]  40.64,49.53 0 top
VPOE  TEST-POINTPOGO_PTH  [1X01_NO_SILK]  34.29,43.18 0 top
VPOE7  TEST-POINTPOGO_PTH  [1X01_NO_SILK]  34.29,19.05 90 top
VUSB  TEST-POINTPOGO_PTH  [1X01_NO_SILK]  38.1,36.83 0 top
VUSB2  TEST-POINTPOGO_PTH  [1X01_NO_SILK]  40.64,36.83 0 top
Y1  25MHz  [CRYSTAL-SMD-2.0X1.6MM]  66.04,76.2 270 top